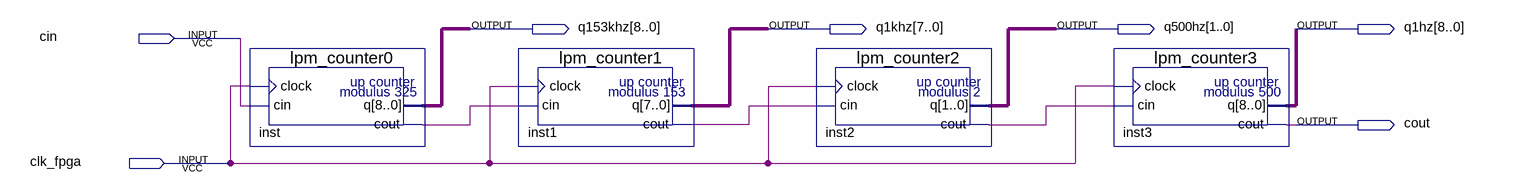
[diagram p0: schematic sheet]
// Quartus schematic divfreq.bdf as structural Verilog: 4 symbols, 7 pins
module divfreq (
  input  cin,
  input  clk_fpga,
  output [8:0] q153khz,
  output [7:0] q1khz,
  output [1:0] q500hz,
  output [8:0] q1hz,
  output cout
);

  wire inst1_cout, inst2_cout, inst_cout;

  lpm_counter0 inst (.clock(clk_fpga), .cin(cin), .cout(inst_cout), .q(q153khz));
  lpm_counter1 inst1 (.clock(clk_fpga), .cin(inst_cout), .cout(inst1_cout), .q(q1khz));
  lpm_counter2 inst2 (.clock(clk_fpga), .cin(inst1_cout), .cout(inst2_cout), .q(q500hz));
  lpm_counter3 inst3 (.clock(clk_fpga), .cin(inst2_cout), .cout(cout), .q(q1hz));
endmodule
